# Altium schematic sheet ui_main.SchDoc: mcHF QRP Transceiver UI board
size A4; Author: K Atanassov; CompanyName: M0NKA; Revision: 0.6.3; SheetTotal: 5
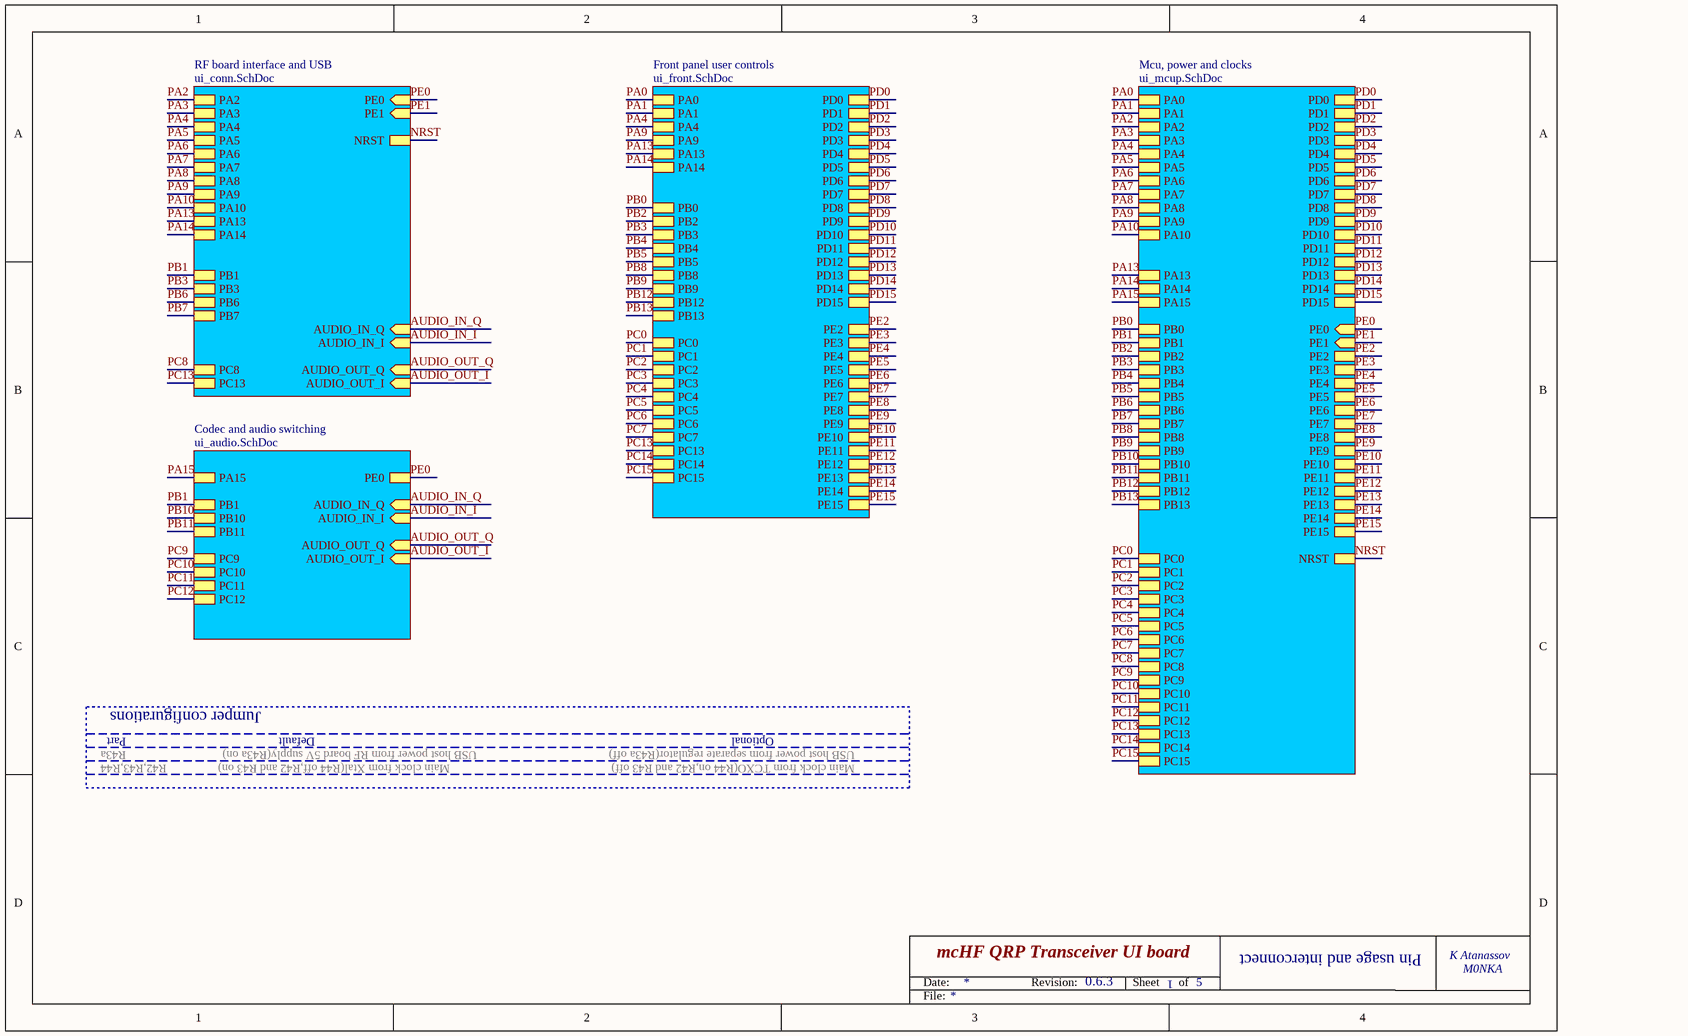
[diagram p0: ui_main.SchDoc]

## Sub-sheets
Codec and audio switching = ui_audio.SchDoc: PA15, PB1, PB10, PB11, PC9, PC11, PC10, PC12, PE0, AUDIO_IN_Q (in), AUDIO_IN_I (in), AUDIO_OUT_Q (in), AUDIO_OUT_I (in)
Front panel user controls = ui_front.SchDoc: PA0, PA1, PB3, PB2, PB0, PB8, PB9, PB12, PB13, PB4, PB5, PC0, PC1, PC2, PC3, PC4, PC5, PC6, PC7, PC13, PC14, PC15, PD0, PD1, PD2, PD3, PD4, PD5, PD6, PD7, PD8, PD9, PD10, PD12, PD11, PD13, PD14, PD15, PE2, PE3, PE4, PE5, PE6, PE7, PE8, PE9, PE10, PE11, PE12, PE13, PE14, PE15, PA13, PA14, PA4, PA9
Mcu, power and clocks = ui_mcup.SchDoc: PD0, PD1, PD2, PD3, PE1 (in), PD4, PD5, PD6, PD7, PD8, PD9, PD10, PD11, PD12, PD13, PD14, PD15, PE2, PE3, PE4, PE5, PE6, PE7, PE8, PE9, PE10, PE11, PE12, PE13, PE14, PE15, PA0, PA1, PA2, PA3, PA4, PA5, PA6, PA7, PA8, PA9, PA10, PA13, PA14, PA15, PE0 (in), PB0, PB1, PB3, PB4, PB5, PB6, PB8, PB7, PB9, PB10, PB11, PB12, PB13, PC1, PC0, PC2, PC3, PC4, PC5, PC6, PC7, PC8, PC9, PC10, PC11, PC12, PC13, PC14, PC15, PB2, NRST
RF board interface and USB = ui_conn.SchDoc: PA3, PA2, PA5, PA6, PA7, PA9, PB1, PA8, PB6, PB7, PC8, PE0 (in), PE1 (in), AUDIO_IN_Q (in), AUDIO_IN_I (in), AUDIO_OUT_Q (in), AUDIO_OUT_I (in), PA10, PC13, PA4, NRST, PA13, PA14, PB3

## Nets
AUDIO_IN_I: sheet Codec and audio switching/AUDIO_IN_I, sheet RF board interface and USB/AUDIO_IN_I
AUDIO_IN_Q: sheet Codec and audio switching/AUDIO_IN_Q, sheet RF board interface and USB/AUDIO_IN_Q
AUDIO_OUT_I: sheet Codec and audio switching/AUDIO_OUT_I, sheet RF board interface and USB/AUDIO_OUT_I
AUDIO_OUT_Q: sheet Codec and audio switching/AUDIO_OUT_Q, sheet RF board interface and USB/AUDIO_OUT_Q
NRST: sheet Mcu, power and clocks/NRST, sheet RF board interface and USB/NRST
PA0: sheet Mcu, power and clocks/PA0, sheet Front panel user controls/PA0
PA1: sheet Mcu, power and clocks/PA1, sheet Front panel user controls/PA1
PA2: sheet Mcu, power and clocks/PA2, sheet RF board interface and USB/PA2
PA3: sheet Mcu, power and clocks/PA3, sheet RF board interface and USB/PA3
PA4: sheet Mcu, power and clocks/PA4, sheet RF board interface and USB/PA4, sheet Front panel user controls/PA4
PA5: sheet Mcu, power and clocks/PA5, sheet RF board interface and USB/PA5
PA6: sheet Mcu, power and clocks/PA6, sheet RF board interface and USB/PA6
PA7: sheet Mcu, power and clocks/PA7, sheet RF board interface and USB/PA7
PA8: sheet Mcu, power and clocks/PA8, sheet RF board interface and USB/PA8
PA9: sheet Mcu, power and clocks/PA9, sheet RF board interface and USB/PA9, sheet Front panel user controls/PA9
PA10: sheet Mcu, power and clocks/PA10, sheet RF board interface and USB/PA10
PA13: sheet Mcu, power and clocks/PA13, sheet RF board interface and USB/PA13, sheet Front panel user controls/PA13
PA14: sheet Mcu, power and clocks/PA14, sheet RF board interface and USB/PA14, sheet Front panel user controls/PA14
PA15: sheet Mcu, power and clocks/PA15, sheet Codec and audio switching/PA15
PB0: sheet Mcu, power and clocks/PB0, sheet Front panel user controls/PB0
PB1: sheet Mcu, power and clocks/PB1, sheet Codec and audio switching/PB1, sheet RF board interface and USB/PB1
PB2: sheet Mcu, power and clocks/PB2, sheet Front panel user controls/PB2
PB3: sheet Mcu, power and clocks/PB3, sheet RF board interface and USB/PB3, sheet Front panel user controls/PB3
PB4: sheet Mcu, power and clocks/PB4, sheet Front panel user controls/PB4
PB5: sheet Mcu, power and clocks/PB5, sheet Front panel user controls/PB5
PB6: sheet Mcu, power and clocks/PB6, sheet RF board interface and USB/PB6
PB7: sheet Mcu, power and clocks/PB7, sheet RF board interface and USB/PB7
PB8: sheet Mcu, power and clocks/PB8, sheet Front panel user controls/PB8
PB9: sheet Mcu, power and clocks/PB9, sheet Front panel user controls/PB9
PB10: sheet Mcu, power and clocks/PB10, sheet Codec and audio switching/PB10
PB11: sheet Mcu, power and clocks/PB11, sheet Codec and audio switching/PB11
PB12: sheet Mcu, power and clocks/PB12, sheet Front panel user controls/PB12
PB13: sheet Mcu, power and clocks/PB13, sheet Front panel user controls/PB13
PC0: sheet Mcu, power and clocks/PC0, sheet Front panel user controls/PC0
PC1: sheet Mcu, power and clocks/PC1, sheet Front panel user controls/PC1
PC2: sheet Mcu, power and clocks/PC2, sheet Front panel user controls/PC2
PC3: sheet Mcu, power and clocks/PC3, sheet Front panel user controls/PC3
PC4: sheet Mcu, power and clocks/PC4, sheet Front panel user controls/PC4
PC5: sheet Mcu, power and clocks/PC5, sheet Front panel user controls/PC5
PC6: sheet Mcu, power and clocks/PC6, sheet Front panel user controls/PC6
PC7: sheet Mcu, power and clocks/PC7, sheet Front panel user controls/PC7
PC8: sheet Mcu, power and clocks/PC8, sheet RF board interface and USB/PC8
PC9: sheet Mcu, power and clocks/PC9, sheet Codec and audio switching/PC9
PC10: sheet Mcu, power and clocks/PC10, sheet Codec and audio switching/PC10
PC11: sheet Mcu, power and clocks/PC11, sheet Codec and audio switching/PC11
PC12: sheet Mcu, power and clocks/PC12, sheet Codec and audio switching/PC12
PC13: sheet Mcu, power and clocks/PC13, sheet RF board interface and USB/PC13, sheet Front panel user controls/PC13
PC14: sheet Mcu, power and clocks/PC14, sheet Front panel user controls/PC14
PC15: sheet Mcu, power and clocks/PC15, sheet Front panel user controls/PC15
PD0: sheet Mcu, power and clocks/PD0, sheet Front panel user controls/PD0
PD1: sheet Mcu, power and clocks/PD1, sheet Front panel user controls/PD1
PD2: sheet Mcu, power and clocks/PD2, sheet Front panel user controls/PD2
PD3: sheet Mcu, power and clocks/PD3, sheet Front panel user controls/PD3
PD4: sheet Mcu, power and clocks/PD4, sheet Front panel user controls/PD4
PD5: sheet Mcu, power and clocks/PD5, sheet Front panel user controls/PD5
PD6: sheet Mcu, power and clocks/PD6, sheet Front panel user controls/PD6
PD7: sheet Mcu, power and clocks/PD7, sheet Front panel user controls/PD7
PD8: sheet Mcu, power and clocks/PD8, sheet Front panel user controls/PD8
PD9: sheet Mcu, power and clocks/PD9, sheet Front panel user controls/PD9
PD10: sheet Mcu, power and clocks/PD10, sheet Front panel user controls/PD10
PD11: sheet Mcu, power and clocks/PD11, sheet Front panel user controls/PD11
PD12: sheet Mcu, power and clocks/PD12, sheet Front panel user controls/PD12
PD13: sheet Mcu, power and clocks/PD13, sheet Front panel user controls/PD13
PD14: sheet Mcu, power and clocks/PD14, sheet Front panel user controls/PD14
PD15: sheet Mcu, power and clocks/PD15, sheet Front panel user controls/PD15
PE0: sheet Mcu, power and clocks/PE0, sheet Codec and audio switching/PE0, sheet RF board interface and USB/PE0
PE1: sheet Mcu, power and clocks/PE1, sheet RF board interface and USB/PE1
PE2: sheet Mcu, power and clocks/PE2, sheet Front panel user controls/PE2
PE3: sheet Mcu, power and clocks/PE3, sheet Front panel user controls/PE3
PE4: sheet Mcu, power and clocks/PE4, sheet Front panel user controls/PE4
PE5: sheet Mcu, power and clocks/PE5, sheet Front panel user controls/PE5
PE6: sheet Mcu, power and clocks/PE6, sheet Front panel user controls/PE6
PE7: sheet Mcu, power and clocks/PE7, sheet Front panel user controls/PE7
PE8: sheet Mcu, power and clocks/PE8, sheet Front panel user controls/PE8
PE9: sheet Mcu, power and clocks/PE9, sheet Front panel user controls/PE9
PE10: sheet Mcu, power and clocks/PE10, sheet Front panel user controls/PE10
PE11: sheet Mcu, power and clocks/PE11, sheet Front panel user controls/PE11
PE12: sheet Mcu, power and clocks/PE12, sheet Front panel user controls/PE12
PE13: sheet Mcu, power and clocks/PE13, sheet Front panel user controls/PE13
PE14: sheet Mcu, power and clocks/PE14, sheet Front panel user controls/PE14
PE15: sheet Mcu, power and clocks/PE15, sheet Front panel user controls/PE15

## Notes on the sheet
- Jumper configurations
- Part
- R43a
- R42,R43,R44
- Default
- Main clock from Xtal(R44 off,R42 and R43 on)
- USB host power from RF board 5V supply(R43a on)
- Optional
- USB host power from separate regulator(R43a off)
- Main clock from TCXO(R44 on,R42 and R43 off)
- 1
- Pin usage and interconnect
- Date:
- Revision:
- Sheet
- of
- File: